# Altium project MB1115.PrjPCB
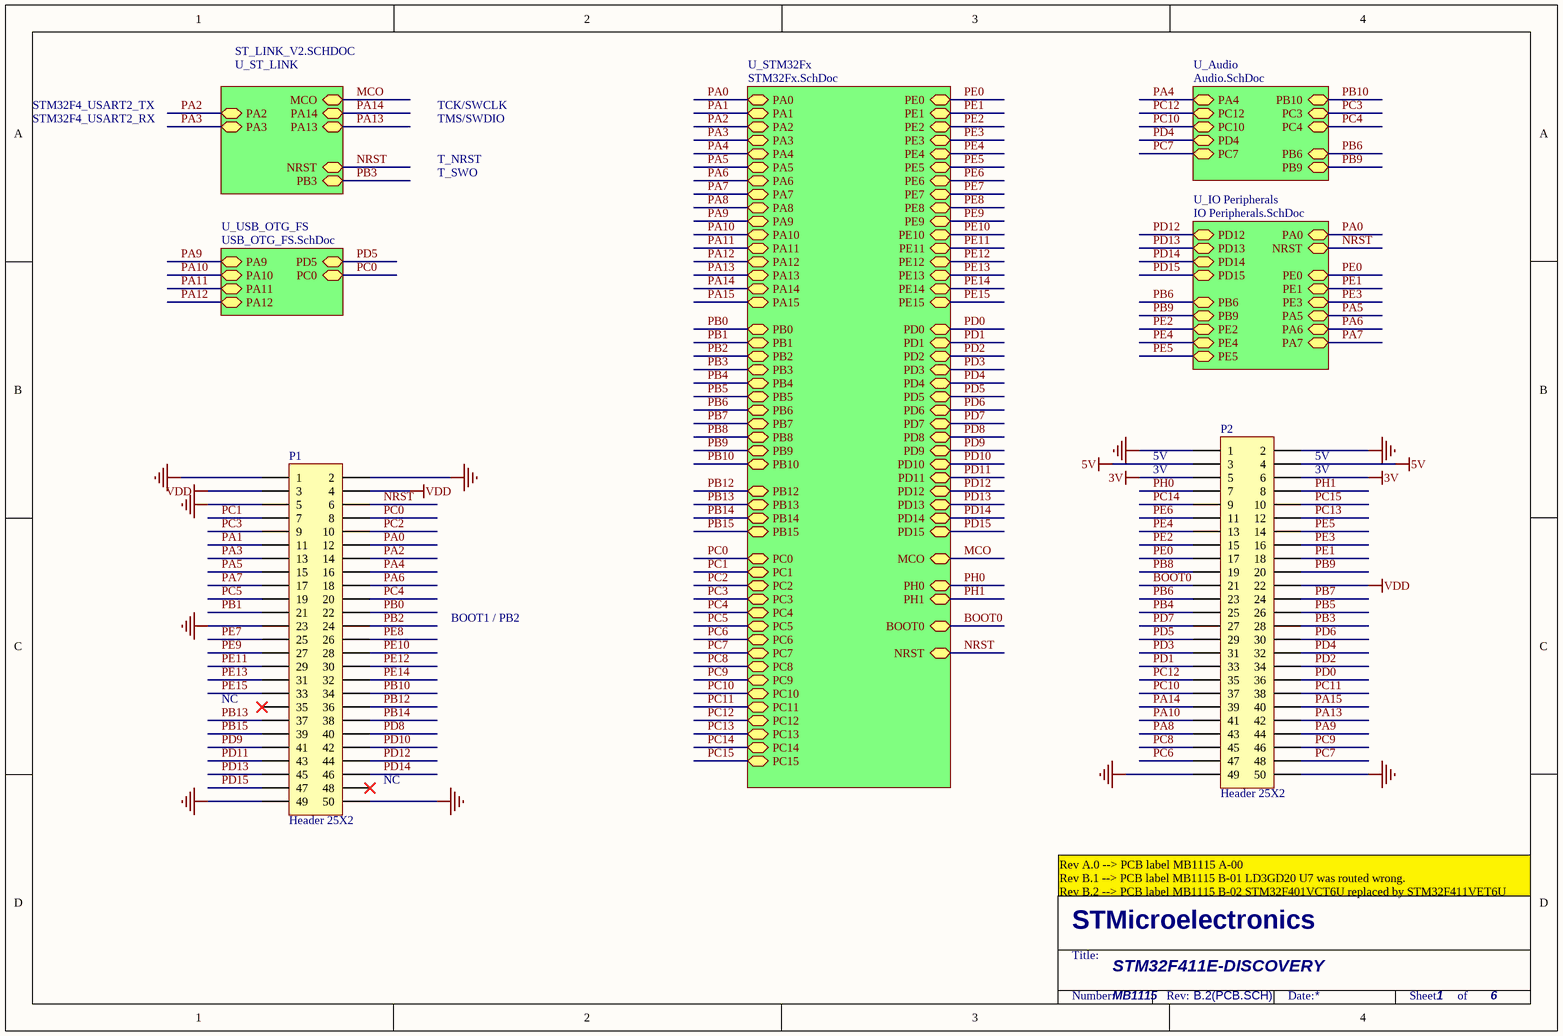
[diagram p0: MB1115.SchDoc]
6 sheets, 194 parts. Net scope: hierarchical (ports join the sheet entries above them; power ports are global).
Sheets:
  MB1115.SchDoc
    U_ST_LINK = ST_LINK_V2.SCHDOC
    U_Audio = Audio.SchDoc
    U_IO Peripherals = IO Peripherals.SchDoc
    U_STM32Fx = STM32Fx.SchDoc
    U_USB_OTG_FS = USB_OTG_FS.SchDoc

## Sheet MB1115.SchDoc
size A4; DocumentNumber: 1; Revision: B.2(PCB.SCH); SheetNumber: 1; SheetTotal: 6; PageSetup: Record=PageOptions|CenterHorizontal=True|CenterVertical=True|PrintScale=1.00|XCorrection=1.00|YCorrection=1.00|PrintKind=1|BorderSize=5000000|LeftOffset=0|BottomOffset=0|Orientation=2|PaperLength=1000|PaperWidth=1000|Scale=100|PaperSource=15|PrintQuality=1200|MediaType=1|DitherType=10|PaperKind=A4|PrintScaleMode=1

### Parts
P1  Header 25X2  [HDR2X25]
P2  Header 25X2  [HDR2X25]

### Sub-sheets
U_Audio = Audio.SchDoc: PA4, PC12, PC10, PD4, PC7, PC3, PB10, PC4, PB6, PB9
U_IO Peripherals = IO Peripherals.SchDoc: PA0, NRST, PE0, PE1, PE3, PA5, PA7, PA6, PE4, PE5, PE2, PB6, PB9, PD12, PD13, PD14, PD15
U_ST_LINK = ST_LINK_V2.SCHDOC: PA13, PA14, NRST, PB3, MCO, PA3, PA2
U_STM32Fx = STM32Fx.SchDoc: PD2, BOOT0, PH1, PH0, NRST, PE0, PE1, PE2, PE3, PE4, PE5, PE6, PE7, PE8, PE9, PE10, PE11, PE12, PE13, PE14, PE15, PD0, PD1, PD3, PD4, PD5, PD6, PD7, PD8, PD9, PD10, PD11, PD12, PD13, PD14, PD15, MCO, PA1, PA2, PA3, PA4, PA5, PA6, PA7, PA8, PA9, PA10, PA11, PA12, PA13, PA14, PA15, PB1, PB2, PB3, PB4, PB5, PB6, PB7, PB8, PB9, PB10, PB12, PB13, PB14, PB15, PC1, PC2, PC3, PC4, PC5, PC6, PC7, PC8, PC9, PC10, PC11, PC12, PC13, PA0, PB0, PC0, PC14, PC15
U_USB_OTG_FS = USB_OTG_FS.SchDoc: PC0, PD5, PA9, PA10, PA11, PA12

### Nets
3V: P2.5 P2.6
5V: P2.3 P2.4
GND: P1.1 P1.2 P1.5 P1.23 P1.49 P1.50 P2.1 P2.2 P2.49 P2.50
VDD: P1.3 P1.4 P2.22
BOOT0: P2.21 ; sheet U_STM32Fx/BOOT0
MCO: sheet U_ST_LINK/MCO, sheet U_STM32Fx/MCO
NRST: P1.6 ; sheet U_ST_LINK/NRST, sheet U_IO Peripherals/NRST, sheet U_STM32Fx/NRST
PA0: P1.12 ; sheet U_IO Peripherals/PA0, sheet U_STM32Fx/PA0
PA1: P1.11 ; sheet U_STM32Fx/PA1
PA2: P1.14 ; sheet U_ST_LINK/PA2, sheet U_STM32Fx/PA2
PA3: P1.13 ; sheet U_ST_LINK/PA3, sheet U_STM32Fx/PA3
PA4: P1.16 ; sheet U_Audio/PA4, sheet U_STM32Fx/PA4
PA5: P1.15 ; sheet U_IO Peripherals/PA5, sheet U_STM32Fx/PA5
PA6: P1.18 ; sheet U_IO Peripherals/PA6, sheet U_STM32Fx/PA6
PA7: P1.17 ; sheet U_IO Peripherals/PA7, sheet U_STM32Fx/PA7
PA8: P2.43 ; sheet U_STM32Fx/PA8
PA9: P2.44 ; sheet U_STM32Fx/PA9, sheet U_USB_OTG_FS/PA9
PA10: P2.41 ; sheet U_STM32Fx/PA10, sheet U_USB_OTG_FS/PA10
PA11: sheet U_STM32Fx/PA11, sheet U_USB_OTG_FS/PA11
PA12: sheet U_STM32Fx/PA12, sheet U_USB_OTG_FS/PA12
PA13: P2.42 ; sheet U_ST_LINK/PA13, sheet U_STM32Fx/PA13
PA14: P2.39 ; sheet U_ST_LINK/PA14, sheet U_STM32Fx/PA14
PA15: P2.40 ; sheet U_STM32Fx/PA15
PB0: P1.22 ; sheet U_STM32Fx/PB0
PB1: P1.21 ; sheet U_STM32Fx/PB1
PB2: P1.24 ; sheet U_STM32Fx/PB2
PB3: P2.28 ; sheet U_ST_LINK/PB3, sheet U_STM32Fx/PB3
PB4: P2.25 ; sheet U_STM32Fx/PB4
PB5: P2.26 ; sheet U_STM32Fx/PB5
PB6: P2.23 ; sheet U_Audio/PB6, sheet U_IO Peripherals/PB6, sheet U_STM32Fx/PB6
PB7: P2.24 ; sheet U_STM32Fx/PB7
PB8: P2.19 ; sheet U_STM32Fx/PB8
PB9: P2.20 ; sheet U_Audio/PB9, sheet U_IO Peripherals/PB9, sheet U_STM32Fx/PB9
PB10: P1.34 ; sheet U_Audio/PB10, sheet U_STM32Fx/PB10
PB12: P1.36 ; sheet U_STM32Fx/PB12
PB13: P1.37 ; sheet U_STM32Fx/PB13
PB14: P1.38 ; sheet U_STM32Fx/PB14
PB15: P1.39 ; sheet U_STM32Fx/PB15
PC0: P1.8 ; sheet U_STM32Fx/PC0, sheet U_USB_OTG_FS/PC0
PC1: P1.7 ; sheet U_STM32Fx/PC1
PC2: P1.10 ; sheet U_STM32Fx/PC2
PC3: P1.9 ; sheet U_Audio/PC3, sheet U_STM32Fx/PC3
PC4: P1.20 ; sheet U_Audio/PC4, sheet U_STM32Fx/PC4
PC5: P1.19 ; sheet U_STM32Fx/PC5
PC6: P2.47 ; sheet U_STM32Fx/PC6
PC7: P2.48 ; sheet U_Audio/PC7, sheet U_STM32Fx/PC7
PC8: P2.45 ; sheet U_STM32Fx/PC8
PC9: P2.46 ; sheet U_STM32Fx/PC9
PC10: P2.37 ; sheet U_Audio/PC10, sheet U_STM32Fx/PC10
PC11: P2.38 ; sheet U_STM32Fx/PC11
PC12: P2.35 ; sheet U_Audio/PC12, sheet U_STM32Fx/PC12
PC13: P2.12 ; sheet U_STM32Fx/PC13
PC14: P2.9 ; sheet U_STM32Fx/PC14
PC15: P2.10 ; sheet U_STM32Fx/PC15
PD0: P2.36 ; sheet U_STM32Fx/PD0
PD1: P2.33 ; sheet U_STM32Fx/PD1
PD2: P2.34 ; sheet U_STM32Fx/PD2
PD3: P2.31 ; sheet U_STM32Fx/PD3
PD4: P2.32 ; sheet U_Audio/PD4, sheet U_STM32Fx/PD4
PD5: P2.29 ; sheet U_STM32Fx/PD5, sheet U_USB_OTG_FS/PD5
PD6: P2.30 ; sheet U_STM32Fx/PD6
PD7: P2.27 ; sheet U_STM32Fx/PD7
PD8: P1.40 ; sheet U_STM32Fx/PD8
PD9: P1.41 ; sheet U_STM32Fx/PD9
PD10: P1.42 ; sheet U_STM32Fx/PD10
PD11: P1.43 ; sheet U_STM32Fx/PD11
PD12: P1.44 ; sheet U_IO Peripherals/PD12, sheet U_STM32Fx/PD12
PD13: P1.45 ; sheet U_IO Peripherals/PD13, sheet U_STM32Fx/PD13
PD14: P1.46 ; sheet U_IO Peripherals/PD14, sheet U_STM32Fx/PD14
PD15: P1.47 ; sheet U_IO Peripherals/PD15, sheet U_STM32Fx/PD15
PE0: P2.17 ; sheet U_IO Peripherals/PE0, sheet U_STM32Fx/PE0
PE1: P2.18 ; sheet U_IO Peripherals/PE1, sheet U_STM32Fx/PE1
PE2: P2.15 ; sheet U_IO Peripherals/PE2, sheet U_STM32Fx/PE2
PE3: P2.16 ; sheet U_IO Peripherals/PE3, sheet U_STM32Fx/PE3
PE4: P2.13 ; sheet U_IO Peripherals/PE4, sheet U_STM32Fx/PE4
PE5: P2.14 ; sheet U_IO Peripherals/PE5, sheet U_STM32Fx/PE5
PE6: P2.11 ; sheet U_STM32Fx/PE6
PE7: P1.25 ; sheet U_STM32Fx/PE7
PE8: P1.26 ; sheet U_STM32Fx/PE8
PE9: P1.27 ; sheet U_STM32Fx/PE9
PE10: P1.28 ; sheet U_STM32Fx/PE10
PE11: P1.29 ; sheet U_STM32Fx/PE11
PE12: P1.30 ; sheet U_STM32Fx/PE12
PE13: P1.31 ; sheet U_STM32Fx/PE13
PE14: P1.32 ; sheet U_STM32Fx/PE14
PE15: P1.33 ; sheet U_STM32Fx/PE15
PH0: P2.7 ; sheet U_STM32Fx/PH0
PH1: P2.8 ; sheet U_STM32Fx/PH1

Not connected (* = marked no-connect by the designer): P1 35* 48*

### Notes on the sheet
- STM32F4_USART2_TX
- TCK/SWCLK
- STM32F4_USART2_RX
- TMS/SWDIO
- T_SWO
- T_NRST
- 5V
- 3V
- (near P2) 5V
- (near P2) 3V
- BOOT1 / PB2
- NC
- (near P1) NC
- Rev A.0 --> PCB label MB1115 A-00
  Rev B.1 --> PCB label MB1115 B-01 LD3GD20 U7 was routed wrong.
  Rev B.2 --> PCB label MB1115 B-02 STM32F401VCT6U replaced by STM32F411VET6U
- STM32F411E-DISCOVERY
- MB1115
- 1
- STMicroelectronics
- Title:
- Number:
- Rev:
- Date:
- Sheet       of

### Library data of the parts
P1 P2 = Header 25X2: Header, 25-Pin, Dual row; LatestRevisionDate: 17-Jul-2002; LatestRevisionNote: Re-released for DXP Platform.; Publisher: Altium Limited

## Sheet ST_LINK_V2.SCHDOC
size A4; DocumentNumber: 2; Revision: B.2(PCB.SCH); SheetNumber: 2; SheetTotal: 6
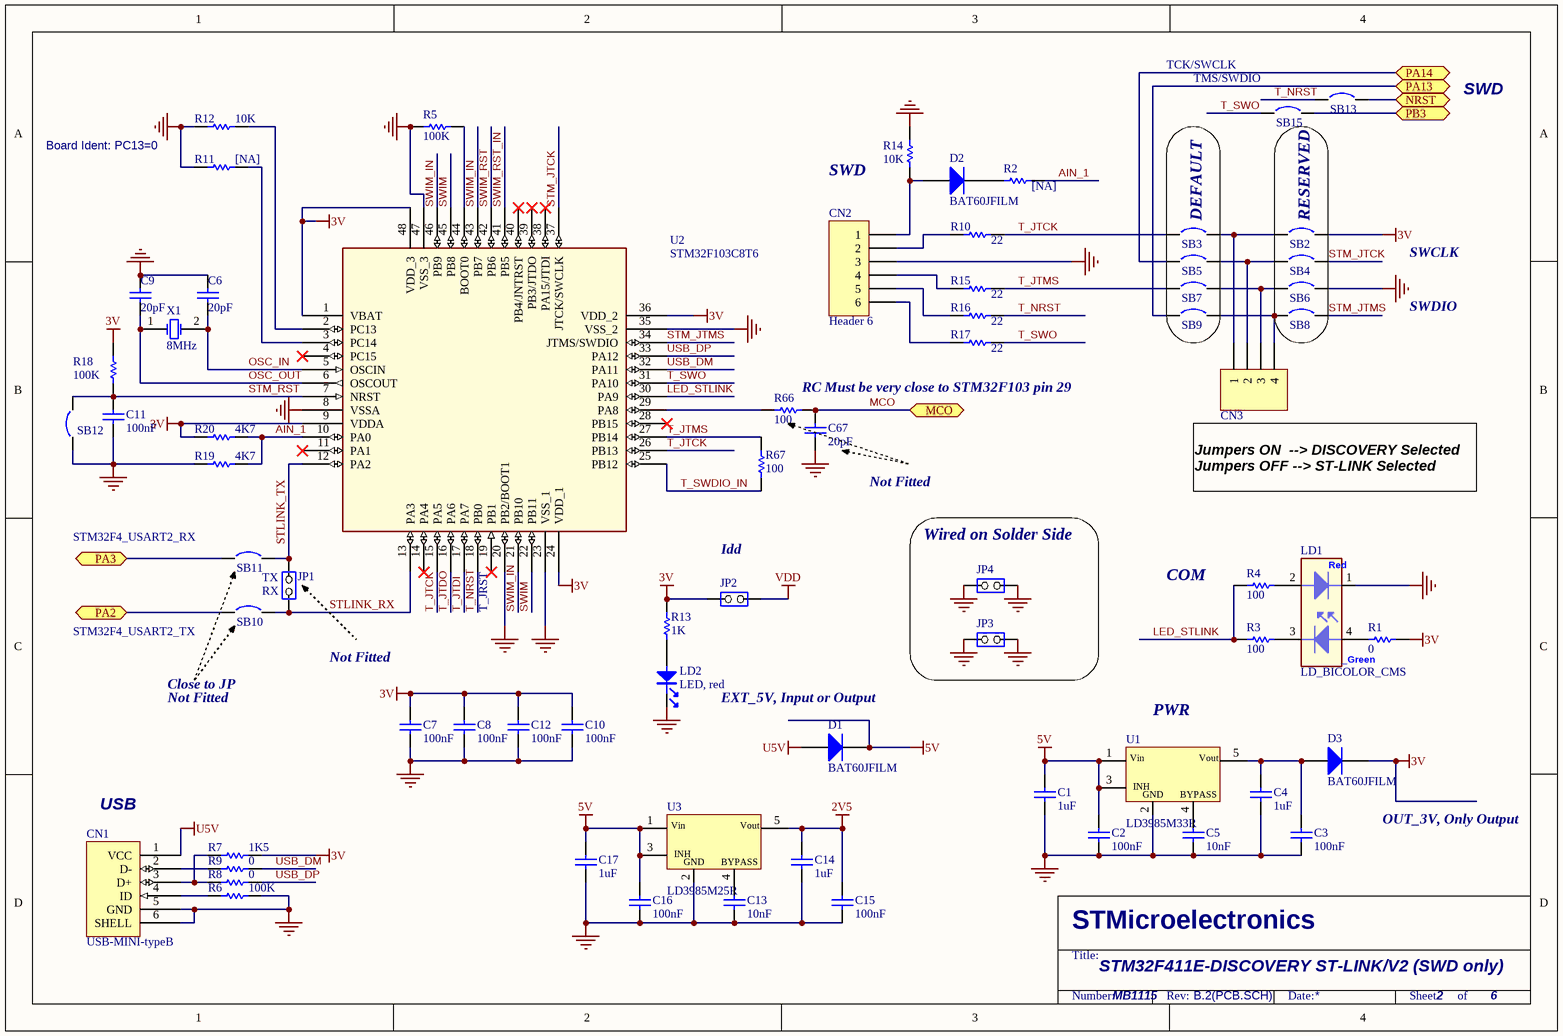
[diagram p1: ST_LINK_V2.SCHDOC]

### Parts
C1  1uF  [0603C]
C2  100nF  [0402C]
C3  100nF  [0402C]
C4  1uF  [0603C]
C5  10nF  [0603C]
C6  20pF  [0402C]
C7  100nF  [0402C]
C8  100nF  [0402C]
C9  20pF  [0402C]
C10  100nF  [0402C]
C11  100nF  [0402C]
C12  100nF  [0402C]
C13  10nF  [0603C]
C14  1uF  [0603C]
C15  100nF  [0402C]
C16  100nF  [0402C]
C17  1uF  [0603C]
C67  20pF  [0402C]
CN1  USB-MINI-typeB  [USB-MINI-B-SMD]
CN2  Header 6  [HDR1X6]
CN3  Header 4  [Header 4]  (value not drawn)
D1  BAT60JFILM  [SOD323/A]
D2  BAT60JFILM  [SOD323/A]
D3  BAT60JFILM  [SOD323/A]
JP1  JP2  [SIP2/2.54]  (value not drawn)
JP2  (no value)  [SIP2/2.54]
JP3  (no value)  [SIP2/2.54]
JP4  (no value)  [SIP2/2.54]
LD1  LD_BICOLOR_CMS  [HSMF-A201]
LD2  LED, red  [0603D]
R1  0  [0402R]
R2  [NA]  [0402R]
R3  100  [0402R]
R4  100  [0402R]
R5  100K  [0402R]
R6  100K  [0402R]
R7  1K5  [0402R]
R8  0  [0402R]
R9  0  [0402R]
R10  22  [0402R]
R11  [NA]  [0402R]
R12  10K  [0402R]
R13  1K  [0402R]
R14  10K  [0402R]
R15  22  [0402R]
R16  22  [0402R]
R17  22  [0402R]
R18  100K  [0402R]
R19  4K7  [0402R]
R20  4K7  [0402R]
R66  100  [0402R]
R67  100  [0402R]
SB2  Circuit Breaker  [JP2_SMD]  (value not drawn)
SB3  Circuit Breaker  [JP2_SMD]  (value not drawn)
SB4  Circuit Breaker  [JP2_SMD]  (value not drawn)
SB5  Circuit Breaker  [JP2_SMD]  (value not drawn)
SB6  Circuit Breaker  [JP2_SMD]  (value not drawn)
SB7  Circuit Breaker  [JP2_SMD]  (value not drawn)
SB8  Circuit Breaker  [JP2_SMD]  (value not drawn)
SB9  Circuit Breaker  [JP2_SMD]  (value not drawn)
SB10  Circuit Breaker  [JP2_SMD]  (value not drawn)
SB11  Circuit Breaker  [JP2_SMD]  (value not drawn)
SB12  Circuit Breaker  [JP2_SMD]  (value not drawn)
SB13  Circuit Breaker  [JP2_SMD]  (value not drawn)
SB15  Circuit Breaker  [JP2_SMD]  (value not drawn)
U1  LD3985M33R  [SOT-23-5L]
U2  STM32F103C8T6  [QFP48 7X7]
U3  LD3985M25R  [SOT-23-5L]
X1  8MHz  [XTAL1]

### Blocks framed on the sheet
DEFAULT: SB3 SB5 SB7 SB9
RESERVED: SB2 SB4 SB6 SB8
Wired on Solder Side: JP3 JP4

### Ports
MCO, NRST, PA2, PA3, PA13, PA14, PB3

### Nets
2V5: C14.1 C15.2 U3.5(Vout)
3V: C7.2 C8.2 C10.2 C12.1 D3.2(K) JP2.1(COMMON) R1.2 R7.2 R13.2 R18.2 R20.1 SB2.2 U2.1(VBAT) U2.9(VDDA) U2.24(VDD_1) U2.36(VDD_2) U2.48(VDD_3)
5V: C1.2 C2.2 C16.2 C17.2 D1.2(K) U1.1(Vin) U1.3(CE) U3.1(Vin) U3.3(CE)
GND: C1.1 C2.1 C3.1 C4.2 C5.1 C6.1 C7.1 C8.1 C9.1 C10.1 C11.1 C12.2 C13.1 C14.2 C15.1 C16.1 C17.1 C67.2 CN1.5(GND) CN1.6(SHELL) CN2.3 JP3.1(COMMON) JP3.2(NO) JP4.1(COMMON) JP4.2(NO) LD1.1 LD2.2 R5.1 R6.2 R11.1 R12.1 R14.2 R19.1 SB6.2 SB12.1 U1.2(GND) U2.8(VSSA) U2.20(PB2/BOOT1) U2.23(VSS_1) U2.35(VSS_2) U2.47(VSS_3) U3.2(GND)
U5V: CN1.1(VCC) D1.1(A)
VDD: JP2.2(NO)
AIN_1: R2.2 R19.2 R20.2 U2.10(PA0)
LED_STLINK: R3.1 R4.1 U2.30(PA9)
MCO: C67.1 R66.2 ; port MCO
NRST: SB13.2 ; port NRST
OSC_IN: C6.2 U2.5(OSCIN) X1.2(OSC2)
OSC_OUT: C9.2 U2.6(OSCOUT) X1.1(OSC1)
PA2: SB10.1 ; port PA2
PA3: SB11.1 ; port PA3
PA13: SB9.1 ; port PA13
PA14: SB5.1 ; port PA14
PB3: SB15.2 ; port PB3
STLINK_RX: JP1.1(COMMON) SB10.2 U2.13(PA3)
STLINK_TX: JP1.2(NO) SB11.2 U2.12(PA2)
STM_JTCK: SB4.2 U2.37(JTCK/SWCLK)
STM_JTMS: SB8.2 U2.34(JTMS/SWDIO)
STM_RST: C11.2 R18.1 SB12.2 U2.7(NRST)
SWIM: U2.22(PB11) U2.45(PB8)
SWIM_IN: U2.21(PB10) U2.43(PB7) U2.46(PB9)
SWIM_RST: U2.42(PB6)
SWIM_RST_IN: U2.41(PB5)
T_JTCK: R10.2 SB3.1 U2.15(PA5) U2.26(PB13)
T_JTDI: U2.17(PA7)
T_JTDO: U2.16(PA6)
T_JTMS: R15.2 R67.2 SB7.1 U2.27(PB14)
T_NRST: R16.2 SB13.1 U2.18(PB0)
T_SWDIO_IN: R67.1 U2.25(PB12)
T_SWO: R17.2 SB15.1 U2.31(PA10)
USB_DM: R9.2 U2.32(PA11)
USB_DP: R8.2 U2.33(PA12)
NetC3_2: C3.2 C4.1 D3.1(A) U1.5(Vout)
NetC5_2: C5.2 U1.4(BYPASS)
NetC13_2: C13.2 U3.4(BYPASS)
NetCN1_2: CN1.2(D-) R9.1
NetCN1_3: CN1.3(D+) R7.1 R8.1
NetCN1_4: CN1.4(ID) R6.1
NetCN2_1: CN2.1 D2.1(A) R14.1
NetCN2_2: CN2.2 R10.1
NetCN2_4: CN2.4 R15.1
NetCN2_5: CN2.5 R16.1
NetCN2_6: CN2.6 R17.1
NetCN3_1: CN3.1 SB2.1 SB3.2
NetCN3_2: CN3.2 SB4.1 SB5.2
NetCN3_3: CN3.3 SB6.1 SB7.2
NetCN3_4: CN3.4 SB8.1 SB9.2
NetD2_2: D2.2(K) R2.1
NetLD1_2: LD1.2 R4.2
NetLD1_3: LD1.3 R3.2
NetLD1_4: LD1.4 R1.1
NetLD2_1: LD2.1 R13.1
NetR5_2: R5.2 U2.44(BOOT0)
NetR11_2: R11.2 U2.3(PC14)
NetR12_2: R12.2 U2.2(PC13)
NetR66_1: R66.1 U2.29(PA8)

Not connected (* = marked no-connect by the designer): U2 4(PC15)* 11(PA1)* 14(PA4)* 19(PB1)* 28(PB15)* 38(PA15/JTDI)* 39(PB3/JTDO)* 40(PB4/JNTRST)*

### Notes on the sheet
- TCK/SWCLK
- (near SB15) TMS/SWDIO
- SWD
- Board Ident: PC13=0
- SWCLK
- SWDIO
- (near R66) RC Must be very close to STM32F103 pin 29
- Not Fitted
- Jumpers ON  --> DISCOVERY Selected
  Jumpers OFF --> ST-LINK Selected
- STM32F4_USART2_RX
- TX
- (near JP2) Idd
- COM
- STM32F4_USART2_TX
- RX
- (near U2) T_JRST
- Close to JP
- EXT_5V, Input or Output
- (near U1) PWR
- (near CN1) USB
- OUT_3V, Only Output
- STM32F411E-DISCOVERY ST-LINK/V2 (SWD only)
- MB1115
- STMicroelectronics
- Title:
- Number:
- Rev:
- Date:
- Sheet       of
- (in symbol LD3985M25R) INH
- (in symbol LD3985M33R) INH
- (in symbol LD_BICOLOR_CMS) Red; _Green

### Library data of the parts
C1 C4 C14 C17 = Cap_1uF_X5R_10%_0603: Capacitor,1uF,16V,X5R,10%,0603,YAGEO; Manuf_Part_1: CC0603KRX5R7BB105; Revision: July-2002: Re-released for DXP Platform.; Value: 1uF; Order: CC0603KRX5R7BB105; Manuf_1: YAGEO
C2 C3 C7 C8 C10-C12 C15 C16 = Cap_100nF_X7R_10%_0402: Capacitor,100nF,16V,X7R,10%,0402,YAGEO; Manuf_Part_1: CC0402KRX7R7BB104; Revision: July-2002: Re-released for DXP Platform.; Value: 100nF; Order: CC0402KRX7R7BB104; Manuf_1: YAGEO
C5 C13 = Cap_10nF_X7R_10%_0603: Capacitor,10nF,50V,X7R,10%,0603,YAGEO; Manuf_Part_1: CC0603KRX7R9BB103; Revision: July-2002: Re-released for DXP Platform.; Value: 10nF; Order: CC0603KRX7R9BB103; Manuf_1: YAGEO
C6 C9 = Cap_20pF_NPO_5%_0402: Capacitor,20pF,50V,NPO,5%,0402,YAGEO; Order: CC0402JRNPO9BN200; Revision: July-2002: Re-released for DXP Platform.; Value: 20pF; Manuf_1: YAGEO; Manuf_Part_1: CC0402JRNPO9BN200
C67 = Cap_20pF_NPO_5%_0402: Capacitor,20pF,50V,NPO,5%,0402,YAGEO; Order: CC0402JRNPO9BN200; Fitted: NO; Revision: July-2002: Re-released for DXP Platform.; Value: 20pF; Manuf_1: YAGEO; Manuf_Part_1: CC0402JRNPO9BN200
CN1 = USB-MINI-typeB connector: Manuf_Part_1: 5075BMR-05-SM; Manuf_Part_2: 218205M1110T; Manuf_2: lyconn; Description: USB,MINI-USB-5P/F, 5075BMR-05-M; Order: 5075BMR-05-SM
CN2 = Header 6: Header, 6-Pin; LatestRevisionDate: 17-Jul-2002; LatestRevisionNote: Re-released for DXP Platform.; Publisher: Altium Limited
CN3 = Header 4: Header, 4-Pin; Revision: 17-Jul-2002: Re-released for DXP Platform.; Publisher: Altium Limited
D1-D3 = BAT60JFILM: Manuf_1: STM; Provided: ST; ECCN_US/EU: EAR99/NEC; Ref St: 9151097; Revision: July-2002: Re-released for DXP Platform.; Order: BAT60JFILM; Manuf_Part_1: BAT60JFILM; Distrib: ST
JP1 = JP2: Fitted: NO
JP2-JP4 = JP2
LD1 = LD_BICOLOR_CMS: Bicolor Led; Manuf_Part_1: HSMF-A201-A00J1; Manuf_1: Avago Technologies; Manuf_2: everluck; Manuf_Part_2: LE-RGW35280; Ref St: xxxxxx; Distrib: RADIOSPARES
LD2 = LED_red: LED, red, 0603; Manuf_1: everlight; Manuf_Part_1: 19-213-R6C-AP1Q2B/3T; Description: LED,red,0603,19-213-R6C-AP1Q2B/3T,everlight; Order: 19-213-R6C-AP1Q2B/3T
R1 R8 R9 = Res_0_0402: Resistor,0,0402; Value: 0
R2 R11 = Res_NA_0402: Resistor,[NA],0402; Fitted: NO; Value: [NA]
R3-R7 R10 R12-R20 R67 = res1: Resistor; Published: 8-Jun-2000; Revision: July-2002: Re-released for DXP Platform.; Publisher: Altium Limited
  R3 R4 R67: Value: 100
  R5 R6 R18: Value: 100K
  R7: Value: 1K5
  R10 R15-R17: Value: 22
  R12 R14: Value: 10K
  R13: Value: 1K
  R19 R20: Value: 4K7
R66 = res1: Resistor; Fitted: NO; Published: 8-Jun-2000; Revision: July-2002: Re-released for DXP Platform.; Publisher: Altium Limited; Value: 100
SB2 SB4 SB6 SB8 SB10-SB12 = Circuit Breaker: Solder: NO; Revision: July-2002: Re-released for DXP Platform.
SB3 SB5 SB7 SB9 SB13 SB15 = Circuit Breaker: Solder: YES; Revision: July-2002: Re-released for DXP Platform.
U1 = LD3985M33R: Ultra low drop-low noise BiCMOS voltage, regulators low ESR capacitors compatible; Manuf_1: STM; Provided: ST; Ref St: 9176161; ECCN_US/EU: EAR99/NEC; Manuf_Part_1: LD3985M33R; Distrib: ST; Order: LD3985M33R
U2 = STM32F103C8T6: Medium-density performance line ARM-based 32-bit MCU with 64KB Flash; Manuf_1: STM; Ref St: 9175981; Provided: ST; ECCN_US/EU: 3A991A2/NEC; Manuf_Part_1: STM32F103C8T6; Distrib: ST; Order: STM32F103C8T6
U3 = LD3985M25R: Ultra low drop-low noise BiCMOS voltage, regulators low ESR capacitors compatible; Manuf_1: STM; Provided: ST; Ref St: 9176007; ECCN_US/EU: EAR99/NEC; Manuf_Part_1: LD3985M25R; Order: LD3985M25R; Distrib: ST
X1 = XTAL_8MHZ_20PPM: Crystal Oscillator,8Mhz,20PF,20PPM,-10-70 degree,DIP,HC-49S; Manuf_Part_1: HC-49S-C20QSA-8.000MHZ; Order: HC-49S-C20QSA-8.000MHZ

## Sheet Audio.SchDoc
size A4; DocumentNumber: 4; Revision: B.2(PCB.SCH); SheetNumber: 4; SheetTotal: 6
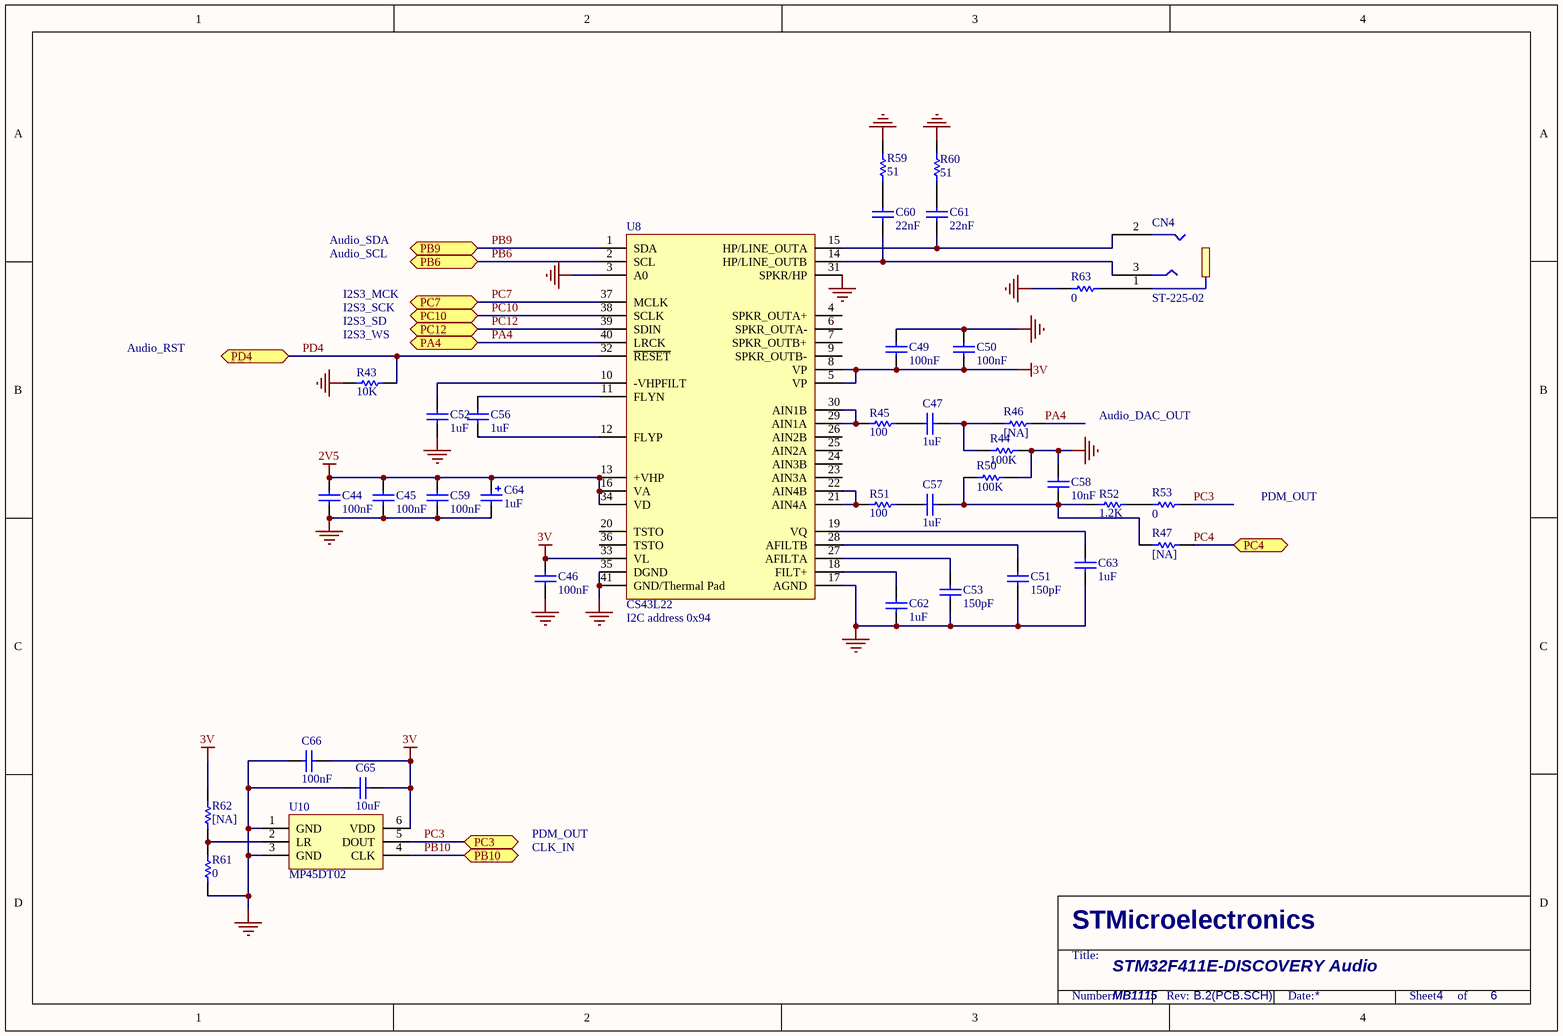
[diagram p2: Audio.SchDoc]

### Parts
C44  100nF  [0402C]
C45  100nF  [0402C]
C46  100nF  [0402C]
C47  1uF  [0603C]
C49  100nF  [0402C]
C50  100nF  [0402C]
C51  150pF  [0603C]
C52  1uF  [0603C]
C53  150pF  [0603C]
C56  1uF  [0603C]
C57  1uF  [0603C]
C58  10nF  [0603C]
C59  100nF  [0402C]
C60  22nF  [0603C]
C61  22nF  [0603C]
C62  1uF  [0603C]
C63  1uF  [0603C]
C64  1uF  [TAN-A]
C65  10uF  [0603C]
C66  100nF  [0402C]
CN4  ST-225-02  [Jack-ST-225]
R43  10K  [0402R]
R44  100K  [0402R]
R45  100  [0402R]
R46  [NA]  [0402R]
R47  [NA]  [0402R]
R50  100K  [0402R]
R51  100  [0402R]
R52  1.2K  [0402R]
R53  0  [0402R]
R59  51  [0402R]
R60  51  [0402R]
R61  0  [0402R]
R62  [NA]  [0402R]
R63  0  [0402R]
U8  CS43L22  [QFN40]
U10  MP45DT02  [HLGA-4.72-3.76-6LD]

### Ports
PA4, PB6, PB9, PB10, PC3, PC4, PC7, PC10, PC12, PD4

### Nets
2V5: C44.2 C45.2 C59.2 C64.1 U8.13(+VHP) U8.16(VA) U8.34(VD)
3V: C46.2 C49.1 C50.2 C65.2 C66.2 R62.2 U8.5(VP) U8.8(VP) U8.33(VL) U10.6(VDD)
GND: C44.1 C45.1 C46.1 C49.2 C50.1 C51.1 C52.2 C53.1 C58.2 C59.1 C62.1 C63.1 C64.2 C65.1 C66.1 R43.2 R44.2 R50.2 R59.2 R60.1 R61.1 R63.1 U8.3(A0) U8.17(AGND) U8.31(SPKR/HP) U8.35(DGND) U8.41(GND/Thermal_Pad) U10.1(GND) U10.3(GND)
PA4: R46.2 U8.40(LRCK) ; port PA4
PB6: U8.2(SCL) ; port PB6
PB9: U8.1(SDA) ; port PB9
PB10: U10.4(CLK) ; port PB10
PC3: R53.2 U10.5(DOUT) ; port PC3
PC4: R47.2 ; port PC4
PC7: U8.37(MCLK) ; port PC7
PC10: U8.38(SCLK) ; port PC10
PC12: U8.39(SDIN) ; port PC12
PD4: R43.1 U8.32(~{RESET}) ; port PD4
NetC47_1: C47.1 R45.1
NetC47_2: C47.2 R44.1 R46.1
NetC51_2: C51.2 U8.28(AFILTB)
NetC52_1: C52.1 U8.10(-VHPFILT)
NetC53_2: C53.2 U8.27(AFILTA)
NetC56_1: C56.1 U8.12(FLYP)
NetC56_2: C56.2 U8.11(FLYN)
NetC57_1: C57.1 R51.1
NetC57_2: C57.2 C58.1 R47.1 R50.1 R52.1
NetC60_1: C60.1 CN4.3 U8.14(HP/LINE_OUTB)
NetC60_2: C60.2 R59.1
NetC61_1: C61.1 CN4.2 U8.15(HP/LINE_OUTA)
NetC61_2: C61.2 R60.2
NetC62_2: C62.2 U8.18(FILT+)
NetC63_2: C63.2 U8.19(VQ)
NetCN4_1: CN4.1 R63.2
NetR45_2: R45.2 U8.29(AIN1A) U8.30(AIN1B)
NetR51_2: R51.2 U8.21(AIN4A) U8.22(AIN4B)
NetR52_2: R52.2 R53.1
NetR61_2: R61.2 R62.1 U10.2(LR)

Not connected (* = marked no-connect by the designer): U8 4(SPKR_OUTA+) 6(SPKR_OUTA-) 7(SPKR_OUTB+) 9(SPKR_OUTB-) 20(TSTO) 23(AIN3A) 24(AIN3B) 25(AIN2A) 26(AIN2B) 36(TSTO)

### Notes on the sheet
- Audio_SDA
- Audio_SCL
- I2S3_MCK
- I2S3_SCK
- Audio_RST
- (near R43) I2S3_WS
- I2S3_SD
- Audio_DAC_OUT
- PDM_OUT
- (near U8) I2C address 0x94
- CLK_IN
- STM32F411E-DISCOVERY Audio
- MB1115
- STMicroelectronics
- Title:
- Number:
- Rev:
- Date:
- Sheet       of

### Library data of the parts
C44-C46 C49 C50 C59 C66 = Cap_100nF_X7R_10%_0402: as C2 on sheet ST_LINK_V2; Revision: July-2002: Re-released for DXP Platform.; Value: 100nF; Order: CC0402KRX7R7BB104; Manuf_1: YAGEO
C47 C52 C56 C57 C62 C63 = Cap_1uF_X5R_10%_0603: as C1 on sheet ST_LINK_V2; Revision: July-2002: Re-released for DXP Platform.; Value: 1uF; Order: CC0603KRX5R7BB105; Manuf_1: YAGEO
C51 C53 = Cap_150pF_NPO_5%_0603: Capacitor,150pF,50V,NPO,5%,0603,YAGEO; Order: CC0603JRNPO9BN151; Revision: July-2002: Re-released for DXP Platform.; Value: 150pF; Manuf_1: YAGEO; Manuf_Part_1: CC0603JRNPO9BN151
C58 = Cap_10nF_X7R_10%_0603: as C5 on sheet ST_LINK_V2; Revision: July-2002: Re-released for DXP Platform.; Value: 10nF; Order: CC0603KRX7R9BB103; Manuf_1: YAGEO
C60 C61 = Cap_22nF_X7R_10%_0603: Capacitor,22nF,50V,X7R,10%,0603,YAGEO; Manuf_Part_1: CC0603KRX7R9BB223; Revision: July-2002: Re-released for DXP Platform.; Value: 22nF; Order: CC0603KRX7R9BB223; Manuf_1: YAGEO
C64 = Cap_1uF_POL_10%_TANA: Polarized Capacitor,1uF,16V,10%,typeA,AVX; Manuf_Part_1: TAJA105K016R; Revision: July-2002: Re-released for DXP Platform.; Value: 1uF; Manuf_1: AVX; Distrib: *; Order: TAJA105K016R
C65 = Cap_10uF_X5R_10%_0603: Capacitor,10uF,6.3V,X5R,20%,0603,YAGEO; Manuf_Part_1: CC0603KRX5R5BB106; Revision: July-2002: Re-released for DXP Platform.; Value: 10uF; Order: CC0603KRX5R5BB106; Manuf_1: YAGEO
CN4 = ST-225-02: Connector Jack 35mm; Manuf_1: XIEJIA Electronics; Order: ST-225-02; Manuf_Part_1: ST-225-02
R43-R45 R50 R51 R59 R60 = res1: Resistor; Value: 1K; Published: 8-Jun-2000; Revision: July-2002: Re-released for DXP Platform.; Publisher: Altium Limited
R46 R47 R62 = Res_NA_0402: Resistor,[NA],0402; Fitted: NO; Value: [NA]
R52 = res1: Resistor; Published: 8-Jun-2000; Revision: July-2002: Re-released for DXP Platform.; Publisher: Altium Limited; Value: 1.2K
R53 R61 R63 = Res_0_0402: Resistor,0,0402; Value: 0
U8 = CS43L22: Low Power, Stereo DAC w/Headphone & Speaker Amps; Manuf_1: Cirrus; Order: CS43L22-CNZ; Manuf_Part_1: CS43L22-CNZ; Distrib: *; ECCN_US/EU: *
U10 = MP45DT02: MEMS audio sensor, omnidirectional digital microphone; Manuf_1: STM; Manuf_Part_1: MP45DT02TR; Provided: ST; Ref St: 9188006; ECCN_US/EU: EAR99/NEC; Order: MP45DT02TR; Distrib: ST

## Sheet IO Peripherals.SchDoc
size A4; DocumentNumber: 6; Revision: B.2(PCB.SCH); SheetNumber: 6; SheetTotal: 6
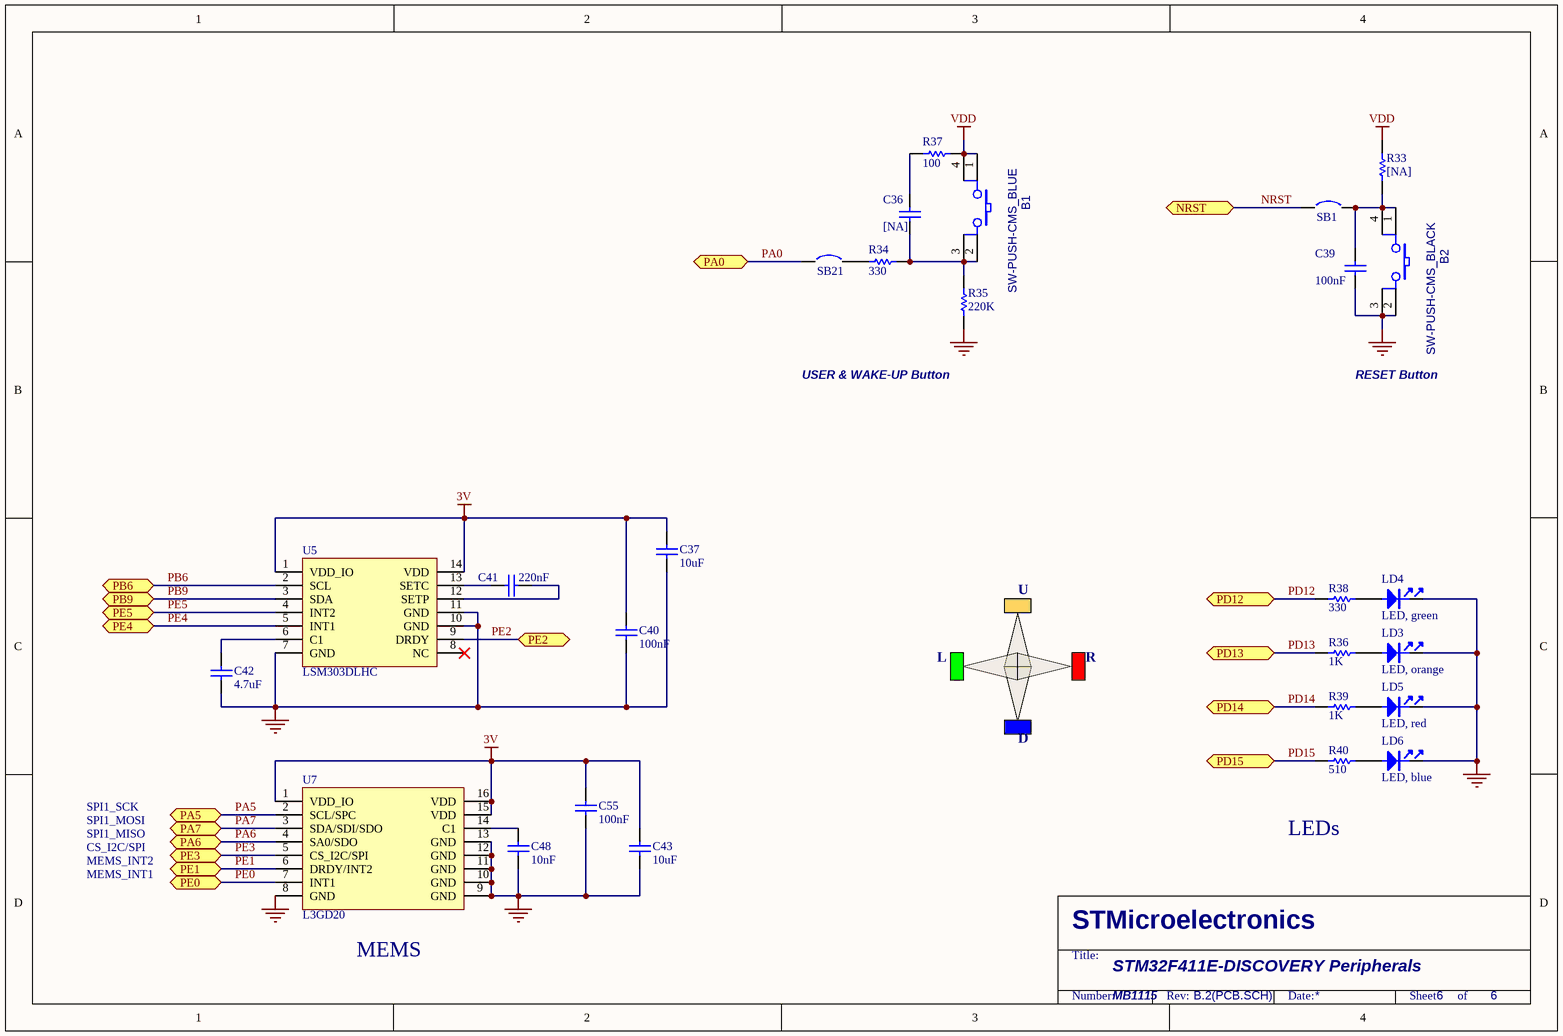
[diagram p3: IO Peripherals.SchDoc]

### Parts
B1  SW-PUSH-CMS_BLUE  [BP1CMS]
B2  SW-PUSH-CMS_BLACK  [BP1CMS]
C36  [NA]  [0402C]
C37  10uF  [0603C]
C39  100nF  [0402C]
C40  100nF  [0402C]
C41  220nF  [0603C]
C42  4.7uF  [0603C]
C43  10uF  [0603C]
C48  10nF  [0603C]
C55  100nF  [0402C]
LD3  LED, orange  [0603D]
LD4  LED, green  [0603D]
LD5  LED, red  [0603D]
LD6  LED, blue  [0603D]
R33  [NA]  [0402R]
R34  330  [0402R]
R35  220K  [0402R]
R36  1K  [0402R]
R37  100  [0402R]
R38  330  [0402R]
R39  1K  [0402R]
R40  510  [0402R]
SB1  Circuit Breaker  [JP2_SMD]  (value not drawn)
SB21  Circuit Breaker  [JP2_SMD]  (value not drawn)
U5  LSM303DLHC  [LGA14(3*5)]
U7  L3GD20  [LGA16-4x4]

### Ports
NRST, PA0, PA5, PA6, PA7, PB6, PB9, PD12, PD13, PD14, PD15, PE0, PE1, PE2, PE3, PE4, PE5

### Nets
3V: C37.2 C40.2 C43.2 C55.2 U5.1(VDD_IO) U5.14(VDD) U7.1(VDD_IO) U7.15(VDD) U7.16(VDD)
GND: B2.2 B2.3 C37.1 C39.1 C40.1 C42.1 C43.1 C48.1 C55.1 LD3.2 LD4.2 LD5.2 LD6.2 R35.1 U5.7(GND) U5.10(GND) U5.11(GND) U7.8(GND) U7.9(GND) U7.10(GND) U7.11(GND) U7.12(GND) U7.13(GND)
VDD: B1.1 B1.4 R33.2 R37.2
NRST: SB1.1 ; port NRST
PA0: SB21.1 ; port PA0
PA5: U7.2(SCL/SPC) ; port PA5
PA6: U7.4(SA0/SDO) ; port PA6
PA7: U7.3(SDA/SDI/SDO) ; port PA7
PB6: U5.2(SCL) ; port PB6
PB9: U5.3(SDA) ; port PB9
PD12: R38.2 ; port PD12
PD13: R36.2 ; port PD13
PD14: R39.2 ; port PD14
PD15: R40.2 ; port PD15
PE0: U7.7(INT1) ; port PE0
PE1: U7.6(DRDY/INT2) ; port PE1
PE2: U5.9(DRDY) ; port PE2
PE3: U7.5(CS_I2C/SPI) ; port PE3
PE4: U5.5(INT1) ; port PE4
PE5: U5.4(INT2) ; port PE5
NetB1_2: B1.2 B1.3 C36.1 R34.2 R35.2
NetB2_1: B2.1 B2.4 C39.2 R33.1 SB1.2
NetC36_2: C36.2 R37.1
NetC41_1: C41.1 U5.13(SETC)
NetC41_2: C41.2 U5.12(SETP)
NetC42_2: C42.2 U5.6(C1)
NetC48_2: C48.2 U7.14(C1)
NetLD3_1: LD3.1 R36.1
NetLD4_1: LD4.1 R38.1
NetLD5_1: LD5.1 R39.1
NetLD6_1: LD6.1 R40.1
NetR34_1: R34.1 SB21.2

Not connected (* = marked no-connect by the designer): U5 8(NC)*

### Notes on the sheet
- USER & WAKE-UP Button
- RESET Button
- U
- L
- R
- D
- SPI1_MOSI
- SPI1_SCK
- SPI1_MISO
- CS_I2C/SPI
- LEDs
- MEMS_INT1
- MEMS_INT2
- (near U7) MEMS
- STM32F411E-DISCOVERY Peripherals
- MB1115
- STMicroelectronics
- Title:
- Number:
- Rev:
- Date:
- Sheet       of

### Library data of the parts
B1 = SW-PUSH-CMS_BLUE: Non-Open Push-Button 0.1A 24V; Manuf_2: FARNELL; Manuf_Part_2: 535-930; Manuf_1: wealthmetal; Manuf_Part_1: TD0341X-G01-BLU; Ref St: 9180120; Description: Non-Open Push Button,Blue 0.1A 24V,Square head,6*6,SMT,180Degree,TD-0341X-GO1,wealthmetal; Distrib: *
B2 = SW-PUSH-CMS_BLACK: Non-Open Push-Button 0.1A 24V; Manuf_2: FARNELL; Manuf_Part_2: 535-930; Manuf_1: wealthmetal; Manuf_Part_1: TD0341X-G01-BLA; Ref St: 9180120; Description: Non-Open Push Button,Black 0.1A 24V,Square head,6*6,SMT,180Degree,TD-0341X-GO1,wealthmetal; Distrib: *
C36 = Cap_NA_0402: Capacitor,NA,0402; Fitted: NO; Revision: July-2002: Re-released for DXP Platform.; Value: [NA]
C37 C43 = Cap_10uF_X5R_10%_0603: as C65 on sheet Audio; Revision: July-2002: Re-released for DXP Platform.; Value: 10uF; Order: CC0603KRX5R5BB106; Manuf_1: YAGEO
C39 C40 C55 = Cap_100nF_X7R_10%_0402: as C2 on sheet ST_LINK_V2; Revision: July-2002: Re-released for DXP Platform.; Value: 100nF; Order: CC0402KRX7R7BB104; Manuf_1: YAGEO
C41 = Cap_220nF_X7R_10%_0603: Capacitor,220nF,16V,X7R,10%,0603,YAGEO; Manuf_Part_1: CC0603KRX7R7BB224; Revision: July-2002: Re-released for DXP Platform.; Value: 220nF; Order: CC0603KRX7R7BB224; Manuf_1: YAGEO
C42 = Cap_4.7uF_X5R_10%_0603: Capacitor,4.7uF,16V, X5R,10%,0603,YAGEO; Manuf_Part_1: CC0603KRX5R7BB475; Order: CC0603KRX5R7BB105; Revision: July-2002: Re-released for DXP Platform.; Value: 4.7uF; Manuf_1: YAGEO
C48 = Cap_10nF_X7R_10%_0603: as C5 on sheet ST_LINK_V2; Revision: July-2002: Re-released for DXP Platform.; Value: 10nF; Order: CC0603KRX7R9BB103; Manuf_1: YAGEO
LD3 = LED_orange: LED, orange, 0603; Manuf_1: everlight; Manuf_Part_1: 19-217/S2C-AM2N2VY/3T; Description: LED,orange,0603,19-217/S2C-AM2N2VY/3T,everlight; Order: 19-217/S2C-AM2N2VY/3T
LD4 = LED_green: LED, green, 0603; Manuf_1: everlight; Manuf_Part_1: 19-213SYGC/S530-E2/TR8; Description: LED,green,0603,19-213SYGC/S530-E2/TR8,everlight; Order: 19-213SYGC/S530-E2/TR8
LD5 = LED_red: as LD2 on sheet ST_LINK_V2; Order: 19-213-R6C-AP1Q2B/3T
LD6 = LED_blue: LED, blue, 0603; Manuf_1: everlight; Manuf_Part_1: 19-217/BHC-ZL1M2RY/3T; Description: LED,Blue,0603,19-217/BHC-ZL1M2RY/3T,everlight; Order: 19-217/BHC-ZL1M2RY/3T
R33 = Res_NA_0402: Resistor,[NA],0402; Fitted: NO; Value: [NA]
R34 = res1: Resistor; Published: 8-Jun-2000; Revision: July-2002: Re-released for DXP Platform.; Publisher: Altium Limited; Value: 330
R35 = res1: Resistor; Value: 10K; Published: 8-Jun-2000; Revision: July-2002: Re-released for DXP Platform.; Publisher: Altium Limited
R36 R39 = Res1: Resistor; Published: 8-Jun-2000; Revision: July-2002: Re-released for DXP Platform.; Publisher: Altium Limited; Value: 1K
R37 = res1: Resistor; Value: 330; Published: 8-Jun-2000; Revision: July-2002: Re-released for DXP Platform.; Publisher: Altium Limited
R38 R40 = Res1: Resistor; Value: 1K; Published: 8-Jun-2000; Revision: July-2002: Re-released for DXP Platform.; Publisher: Altium Limited
SB1 SB21 = Circuit Breaker: Solder: YES; Revision: July-2002: Re-released for DXP Platform.
U5 = LSM303DLHC: Ultra compact high performance e-compass 3D accelerometer and 3D magnetometer module; Manuf_1: STM; Manuf_Part_1: LSM303DLHCTR; Provided: ST; Ref St: 9177037; ECCN_US/EU: EAR99/NEC; Distrib: ST; Order: LSM303DLHCTR
U7 = L3GD20: MEMS motion sensor three-axis digital output gyroscopeelerometer; Manuf_1: STM; Manuf_Part_1: L3GD20TR; Provided: ST; Ref St: 9177042; ECCN_US/EU: EAR99/NEC; Distrib: ST; Footprint: LGA16(4*4); Order: L3GD20TR

## Sheet STM32Fx.SchDoc
size A4; DocumentNumber: 3; Revision: B.2(PCB.SCH); SheetNumber: 3; SheetTotal: 6
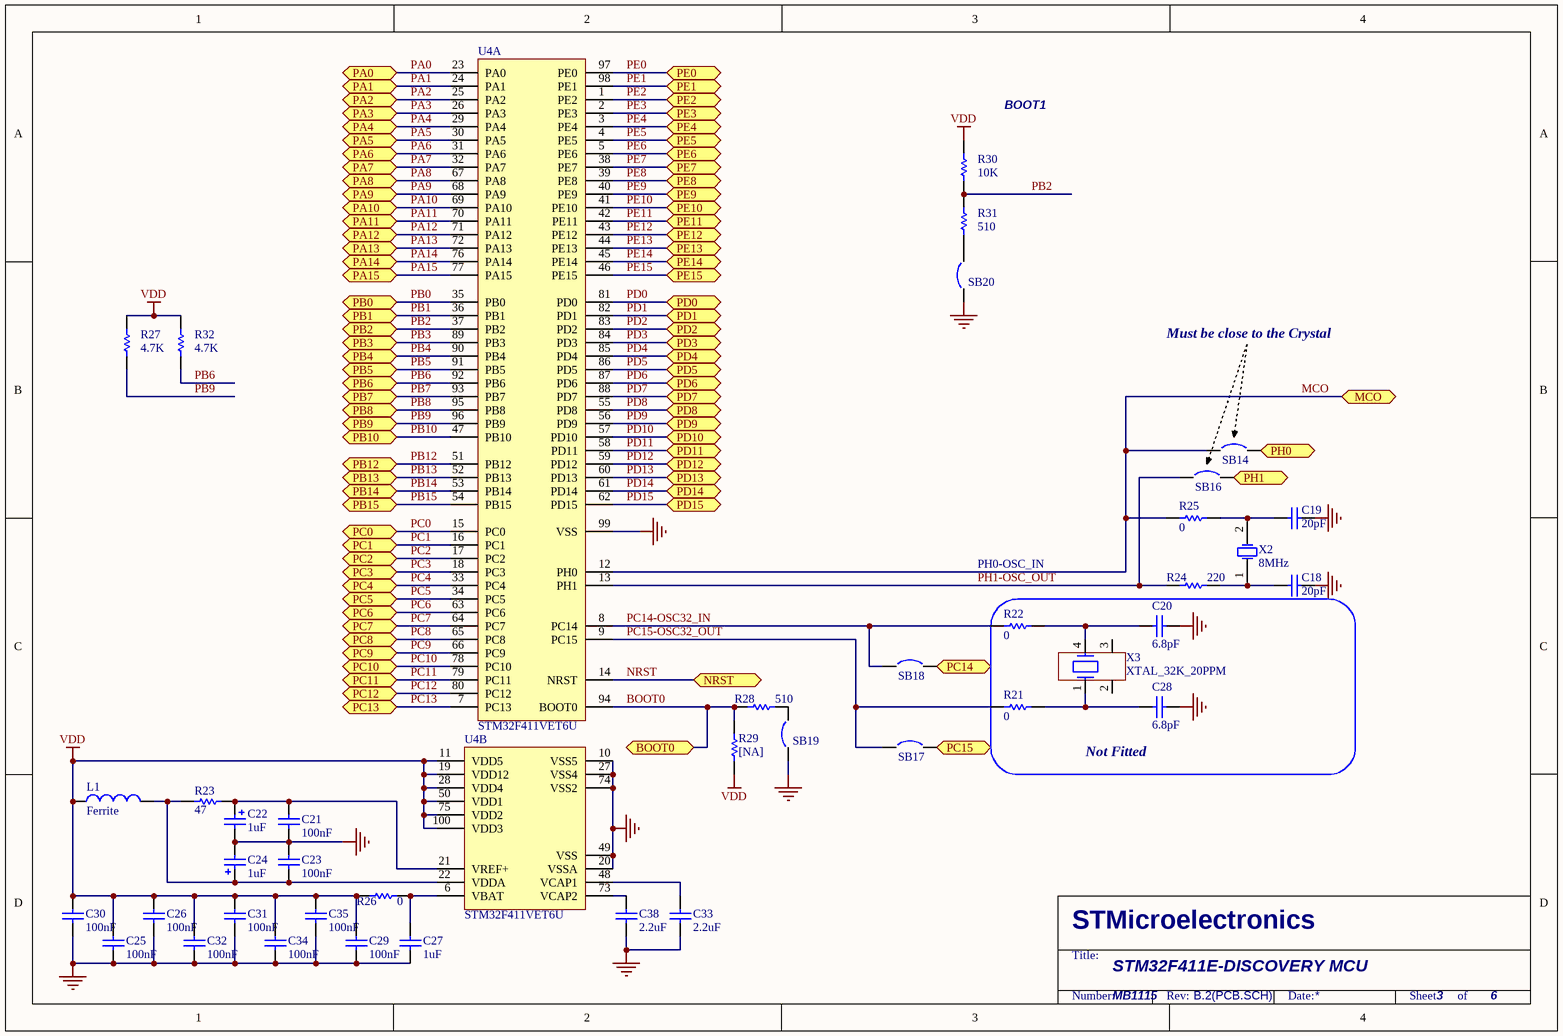
[diagram p4: STM32Fx.SchDoc]

### Parts
C18  20pF  [0402C]
C19  20pF  [0402C]
C20  6.8pF  [0402C]
C21  100nF  [0402C]
C22  1uF  [TAN-A]
C23  100nF  [0402C]
C24  1uF  [TAN-A]
C25  100nF  [0402C]
C26  100nF  [0402C]
C27  1uF  [0603C]
C28  6.8pF  [0402C]
C29  100nF  [0402C]
C30  100nF  [0402C]
C31  100nF  [0402C]
C32  100nF  [0402C]
C33  2.2uF  [TAN-A]
C34  100nF  [0402C]
C35  100nF  [0402C]
C38  2.2uF  [TAN-A]
L1  Ferrite  [0603L]
R21  0  [0402R]
R22  0  [0402R]
R23  47  [0402R]
R24  220  [0402R]
R25  0  [0402R]
R26  0  [0402R]
R27  4.7K  [0402R]
R28  510  [0402R]
R29  [NA]  [0402R]
R30  10K  [0402R]
R31  510  [0402R]
R32  4.7K  [0402R]
SB14  Circuit Breaker  [JP2_SMD]  (value not drawn)
SB16  Circuit Breaker  [JP2_SMD]  (value not drawn)
SB17  Circuit Breaker  [JP2_SMD]  (value not drawn)
SB18  Circuit Breaker  [JP2_SMD]  (value not drawn)
SB19  Circuit Breaker  [JP2_SMD]  (value not drawn)
SB20  Circuit Breaker  [JP2_SMD]  (value not drawn)
U4  STM32F411VET6U  [TQFP100]  (parts A,B of 2)
X2  8MHz  [XTAL1]
X3  XTAL_32K_20PPM  [MC306-CRYSTAL]

### Blocks framed on the sheet
Not Fitted: C20 C28 R21 R22 X3

### Ports
BOOT0, MCO, NRST, PA0, PA1, PA2, PA3, PA4, PA5, PA6, PA7, PA8, PA9, PA10, PA11, PA12, PA13, PA14, PA15, PB0, PB1, PB2, PB3, PB4, PB5, PB6, PB7, PB8, PB9, PB10, PB12, PB13, PB14, PB15, PC0, PC1, PC2, PC3, PC4, PC5, PC6, PC7, PC8, PC9, PC10, PC11, PC12, PC13, PC14, PC15, PD0, PD1, PD2, PD3, PD4, PD5, PD6, PD7, PD8, PD9, PD10, PD11, PD12, PD13, PD14, PD15, PE0, PE1, PE2, PE3, PE4, PE5, PE6, PE7, PE8, PE9, PE10, PE11, PE12, PE13, PE14, PE15, PH0, PH1

### Nets
GND: C18.1 C19.1 C20.2 C21.1 C22.2 C23.1 C24.2 C25.1 C26.2 C27.2 C28.2 C29.1 C30.1 C31.1 C32.1 C33.2 C34.1 C35.2 C38.2 SB19.1 SB20.1 U4.10(VSS5) U4.20(VSSA) U4.27(VSS4) U4.49(VSS) U4.74(VSS2) U4.99(VSS)
VDD: C25.2 C26.1 C29.2 C30.2 C31.2 C32.2 C34.2 C35.1 L1.1 R26.1 R27.1 R29.1 R30.1 R32.1 U4.11(VDD5) U4.19(VDD12) U4.28(VDD4) U4.50(VDD1) U4.75(VDD2) U4.100(VDD3)
BOOT0: R28.2 R29.2 U4.94(BOOT0) ; port BOOT0
MCO: R25.1 SB14.1 U4.12(PH0) ; port MCO
NRST: U4.14(NRST) ; port NRST
PA0: U4.23(PA0) ; port PA0
PA1: U4.24(PA1) ; port PA1
PA2: U4.25(PA2) ; port PA2
PA3: U4.26(PA3) ; port PA3
PA4: U4.29(PA4) ; port PA4
PA5: U4.30(PA5) ; port PA5
PA6: U4.31(PA6) ; port PA6
PA7: U4.32(PA7) ; port PA7
PA8: U4.67(PA8) ; port PA8
PA9: U4.68(PA9) ; port PA9
PA10: U4.69(PA10) ; port PA10
PA11: U4.70(PA11) ; port PA11
PA12: U4.71(PA12) ; port PA12
PA13: U4.72(PA13) ; port PA13
PA14: U4.76(PA14) ; port PA14
PA15: U4.77(PA15) ; port PA15
PB0: U4.35(PB0) ; port PB0
PB1: U4.36(PB1) ; port PB1
PB2: R30.2 R31.1 U4.37(PB2) ; port PB2
PB3: U4.89(PB3) ; port PB3
PB4: U4.90(PB4) ; port PB4
PB5: U4.91(PB5) ; port PB5
PB6: R32.2 U4.92(PB6) ; port PB6
PB7: U4.93(PB7) ; port PB7
PB8: U4.95(PB8) ; port PB8
PB9: R27.2 U4.96(PB9) ; port PB9
PB10: U4.47(PB10) ; port PB10
PB12: U4.51(PB12) ; port PB12
PB13: U4.52(PB13) ; port PB13
PB14: U4.53(PB14) ; port PB14
PB15: U4.54(PB15) ; port PB15
PC0: U4.15(PC0) ; port PC0
PC1: U4.16(PC1) ; port PC1
PC2: U4.17(PC2) ; port PC2
PC3: U4.18(PC3) ; port PC3
PC4: U4.33(PC4) ; port PC4
PC5: U4.34(PC5) ; port PC5
PC6: U4.63(PC6) ; port PC6
PC7: U4.64(PC7) ; port PC7
PC8: U4.65(PC8) ; port PC8
PC9: U4.66(PC9) ; port PC9
PC10: U4.78(PC10) ; port PC10
PC11: U4.79(PC11) ; port PC11
PC12: U4.80(PC12) ; port PC12
PC13: U4.7(PC13) ; port PC13
PC14: SB18.2 ; port PC14
PC14-OSC32_IN: R22.1 SB18.1 U4.8(PC14)
PC15: SB17.2 ; port PC15
PC15-OSC32_OUT: R21.1 SB17.1 U4.9(PC15)
PD0: U4.81(PD0) ; port PD0
PD1: U4.82(PD1) ; port PD1
PD2: U4.83(PD2) ; port PD2
PD3: U4.84(PD3) ; port PD3
PD4: U4.85(PD4) ; port PD4
PD5: U4.86(PD5) ; port PD5
PD6: U4.87(PD6) ; port PD6
PD7: U4.88(PD7) ; port PD7
PD8: U4.55(PD8) ; port PD8
PD9: U4.56(PD9) ; port PD9
PD10: U4.57(PD10) ; port PD10
PD11: U4.58(PD11) ; port PD11
PD12: U4.59(PD12) ; port PD12
PD13: U4.60(PD13) ; port PD13
PD14: U4.61(PD14) ; port PD14
PD15: U4.62(PD15) ; port PD15
PE0: U4.97(PE0) ; port PE0
PE1: U4.98(PE1) ; port PE1
PE2: U4.1(PE2) ; port PE2
PE3: U4.2(PE3) ; port PE3
PE4: U4.3(PE4) ; port PE4
PE5: U4.4(PE5) ; port PE5
PE6: U4.5(PE6) ; port PE6
PE7: U4.38(PE7) ; port PE7
PE8: U4.39(PE8) ; port PE8
PE9: U4.40(PE9) ; port PE9
PE10: U4.41(PE10) ; port PE10
PE11: U4.42(PE11) ; port PE11
PE12: U4.43(PE12) ; port PE12
PE13: U4.44(PE13) ; port PE13
PE14: U4.45(PE14) ; port PE14
PE15: U4.46(PE15) ; port PE15
PH0: SB14.2 ; port PH0
PH1: SB16.2 ; port PH1
PH1-OSC_OUT: R24.2 SB16.1 U4.13(PH1)
NetC18_2: C18.2 R24.1 X2.1(OSC1)
NetC19_2: C19.2 R25.2 X2.2(OSC2)
NetC20_1: C20.1 R22.2 X3.4
NetC21_2: C21.2 C22.1 R23.1 U4.21(VREF+)
NetC23_2: C23.2 C24.1 L1.2 R23.2 U4.22(VDDA)
NetC27_1: C27.1 R26.2 U4.6(VBAT)
NetC28_1: C28.1 R21.2 X3.1
NetC33_1: C33.1 U4.48(VCAP1)
NetC38_1: C38.1 U4.73(VCAP2)
NetR28_1: R28.1 SB19.2
NetR31_2: R31.2 SB20.2

Not connected (* = marked no-connect by the designer): X3 2 3

### Notes on the sheet
- BOOT1
- Must be close to the Crystal
- PH0-OSC_IN
- STM32F411E-DISCOVERY MCU
- MB1115
- STMicroelectronics
- Title:
- Number:
- Rev:
- Date:
- Sheet       of

### Library data of the parts
C18 C19 = Cap_20pF_NPO_5%_0402: as C6 on sheet ST_LINK_V2; Revision: July-2002: Re-released for DXP Platform.; Value: 20pF; Manuf_1: YAGEO; Manuf_Part_1: CC0402JRNPO9BN200
C20 C28 = Cap_6.8pF_NPO_4%_0402: Capacitor,6.8pF,50V,NPO,4%,0402,AVX; Order: 04025A6R8CAT2A; Fitted: NO; Revision: July-2002: Re-released for DXP Platform.; Value: 6.8pF; Manuf_1: AVX; Manuf_Part_1: 04025A6R8CAT2A
C21 C23 C25 C26 C29-C32 C34 C35 = Cap_100nF_X7R_10%_0402: as C2 on sheet ST_LINK_V2; Revision: July-2002: Re-released for DXP Platform.; Value: 100nF; Order: CC0402KRX7R7BB104; Manuf_1: YAGEO
C22 C24 = Cap_1uF_POL_10%_TANA: as C64 on sheet Audio; Revision: July-2002: Re-released for DXP Platform.; Value: 1uF; Order: TAJA105K016R; Manuf_1: AVX; Distrib: *
C27 = Cap_1uF_X5R_10%_0603: as C1 on sheet ST_LINK_V2; Revision: July-2002: Re-released for DXP Platform.; Value: 1uF; Order: CC0603KRX5R7BB105; Manuf_1: YAGEO
C33 C38 = Cap_2.2uF_X7R_10%_0805: Capacitor,2.2uF,16V, X7R,10%,0805,YAGEO; Manuf_Part_1: CC0805KKX7R7BB225; Revision: July-2002: Re-released for DXP Platform.; Value: 2.2uF; Order: CC0805KKX7R7BB225; Manuf_1: YAGEO
L1 = BEAD_600R_350MA_0603: Bead,600R,350mA,0603,FCM1608KF-601T03,Tai-tech; Manuf_2: TDK; Manuf_Part_2: MPZ1608S300A; Value: 100uH; Comment_1: bead,30R,5A,0603,MPZ1608S300A,TDK; Revision: July-2002: Re-released for DXP Platform.; Manuf_Part_1: FCM1608KF-601T03; Order: FCM1608KF-601T03; Manuf_1: Tai-tech
R21 R22 = Res_0_0402: Resistor,0,0402; Fitted: NO; Value: 0
R23 = Res1: Resistor; Value: 1K; Published: 8-Jun-2000; Revision: July-2002: Re-released for DXP Platform.; Publisher: Altium Limited
R24 R28 = Res1: Resistor; Published: 8-Jun-2000; Revision: July-2002: Re-released for DXP Platform.; Publisher: Altium Limited
  R24: Value: 220
  R28: Value: 510
R25 R26 = Res_0_0402: Resistor,0,0402; Value: 0
R27 R32 = res1: Resistor; Value: 10K; Published: 8-Jun-2000; Revision: July-2002: Re-released for DXP Platform.; Publisher: Altium Limited
R29 = Res_NA_0402: Resistor,[NA],0402; Fitted: NO; Value: [NA]
R30 R31 = res1: Resistor; Published: 8-Jun-2000; Revision: July-2002: Re-released for DXP Platform.; Publisher: Altium Limited
  R30: Value: 10K
  R31: Value: 510
SB14 SB16 SB20 = Circuit Breaker: Solder: NO; Revision: July-2002: Re-released for DXP Platform.
SB17-SB19 = Circuit Breaker: Solder: YES; Revision: July-2002: Re-released for DXP Platform.
U4 = STM32F401VCT6U: STM32 Tiny Manta (STM32F401VCT6U); Manuf_1: STM; Provided: ST; Ref St: 9175846; ECCN_US/EU: 3A991A2/NEC; Manuf_Part_1: STM32F401VCT6U; Distrib: ST; Footprint: QFP100
X2 = XTAL_8MHZ_20PPM: as X1 on sheet ST_LINK_V2; Order: HC-49S-C20QSA-8.000MHZ
X3 = XTAL_32K: Crystal oscillator for clock,32.768K,6PF,20PPM,-40~85 degree,SMT; Manuf_Part_1: ETMB32.768W060BMPF; Description: crystal oscillator for clock,32.768K,6PF,20PPM,-40~85 degree,SMT,ETMB32.768W060BMPF; Comment_1: MC306-G-06Q-32.768; Fitted: NO; Order: ETMB32.768W060BMPF

## Sheet USB_OTG_FS.SchDoc
size A4; DocumentNumber: 5; Revision: B.2(PCB.SCH); SheetNumber: 5; SheetTotal: 6
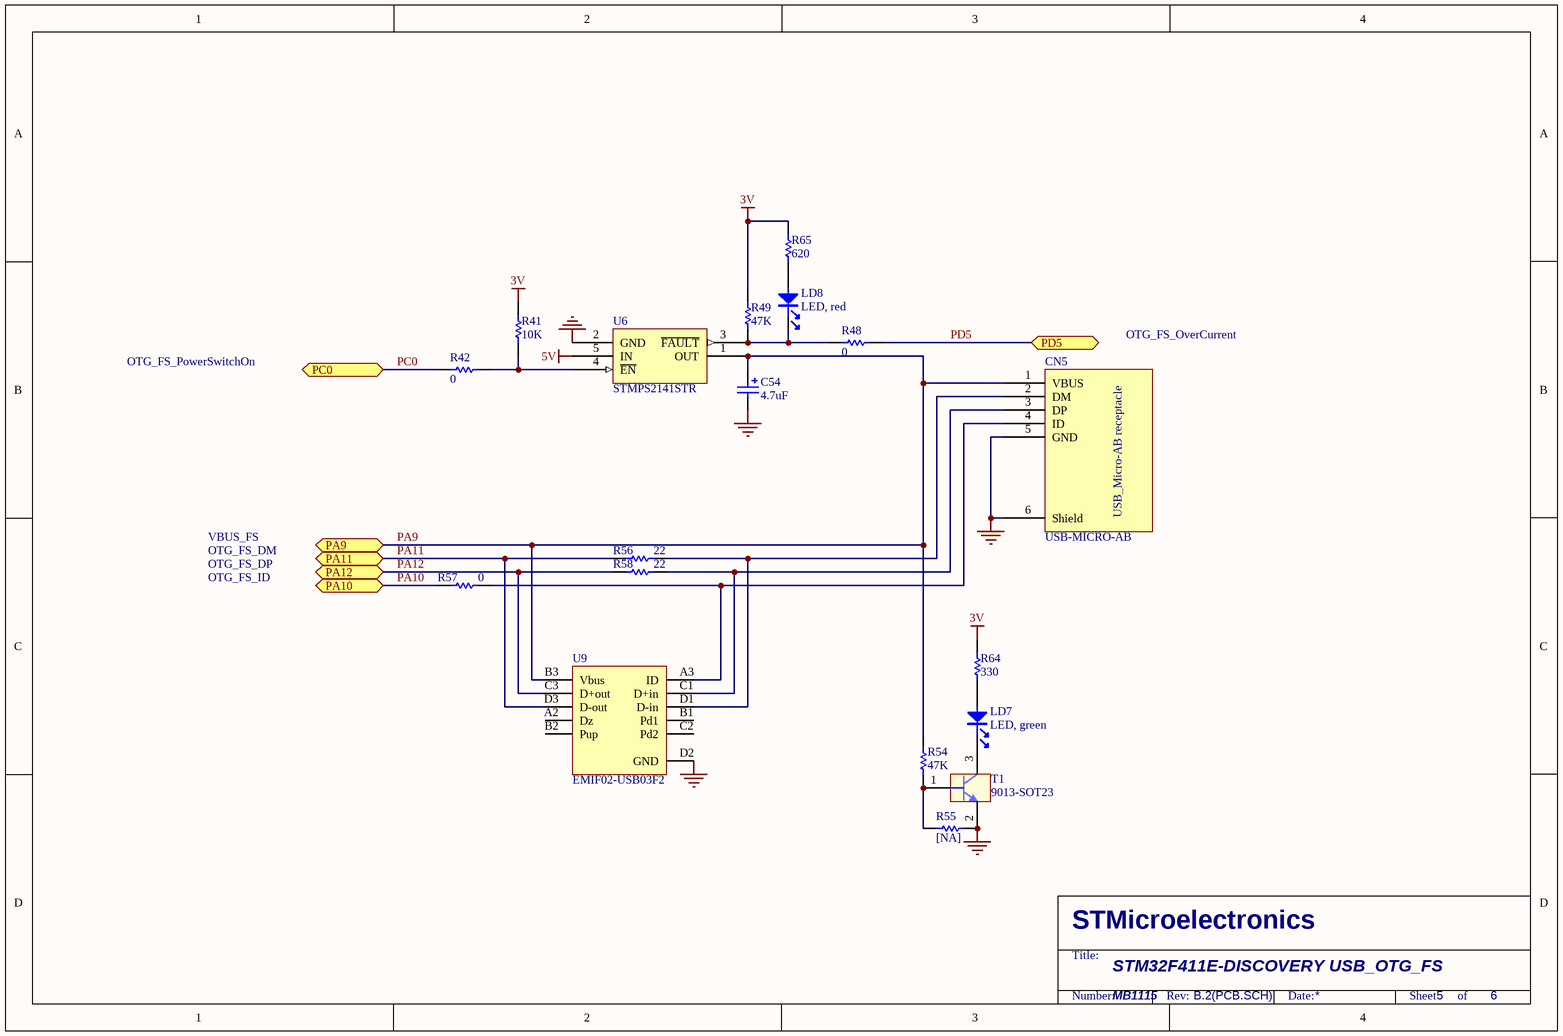
[diagram p5: USB_OTG_FS.SchDoc]

### Parts
C54  4.7uF  [TAN-A]
CN5  USB-MICRO-AB  [USB-MICRO-AB]
LD7  LED, green  [0603D]
LD8  LED, red  [0603D]
R41  10K  [0402R]
R42  0  [0402R]
R48  0  [0402R]
R49  47K  [0402R]
R54  47K  [0402R]
R55  [NA]  [0402R]
R56  22  [0402R]
R57  0  [0402R]
R58  22  [0402R]
R64  330  [0603R]
R65  620  [0603R]
T1  9013-SOT23  [SOT-23]
U6  STMPS2141STR  [SOT23-5L]
U9  EMIF02-USB03F2  [Flip Chip]

### Ports
PA9, PA10, PA11, PA12, PC0, PD5

### Nets
3V: R41.1 R49.1 R64.2 R65.2
5V: U6.5(IN)
GND: C54.2 CN5.5(GND) CN5.6(Shield) R55.2 T1.2(E) U6.2(GND) U9.D2(GND)
PA9: C54.1 CN5.1(VBUS) R54.2 U6.1(OUT) U9.B3(Vbus) ; port PA9
PA10: R57.1 ; port PA10
PA11: R56.2 U9.D3(D-out) ; port PA11
PA12: R58.2 U9.C3(D+out) ; port PA12
PC0: R42.1 ; port PC0
PD5: R48.2 ; port PD5
NetCN5_2: CN5.2(DM) R56.1 U9.D1(D-in)
NetCN5_3: CN5.3(DP) R58.1 U9.C1(D+in)
NetCN5_4: CN5.4(ID) R57.2 U9.A3(ID)
NetLD7_1: LD7.1 R64.1
NetLD7_2: LD7.2 T1.3(C)
NetLD8_1: LD8.1 R65.1
NetLD8_2: LD8.2 R48.1 R49.2 U6.3(~{FAULT})
NetR41_2: R41.2 R42.2 U6.4(~{EN})
NetR54_1: R54.1 R55.1 T1.1(B)

Not connected (* = marked no-connect by the designer): U9 A2(Dz) B1(Pd1) B2(Pup) C2(Pd2)

### Notes on the sheet
- OTG_FS_PowerSwitchOn
- OTG_FS_OverCurrent
- VBUS_FS
- OTG_FS_ID
- OTG_FS_DM
- OTG_FS_DP
- STM32F411E-DISCOVERY USB_OTG_FS
- MB1115
- STMicroelectronics
- Title:
- Number:
- Rev:
- Date:
- Sheet       of
- (in symbol USB-MICRO-AB) USB_Micro-AB receptacle

### Library data of the parts
C54 = Cap_4.7uF_POL_10%_TANA: Polarized Capacitor,4.7uF,16V,10%,typeA,AVX; Manuf_Part_1: TAJA475K016R; Revision: July-2002: Re-released for DXP Platform.; Value: 4.7uF; Manuf_1: AVX; Order: TAJA475K016R
CN5 = USB-MICRO-AB: USB-MICRO-AB, 47590-0001, SMT, MOLEX; Ref St: xxxxxxx; Manuf_1: MOLEX; Manuf_Part_1: 47590-0001; ECCN_US/EU: *; Distrib: *
LD7 = LED_green: as LD4 on sheet IO Peripherals; Order: 19-213SYGC/S530-E2/TR8
LD8 = LED_red: as LD2 on sheet ST_LINK_V2; Order: 19-213-R6C-AP1Q2B/3T
R41 R49 R54 R64 = res1: Resistor; Value: 1K; Published: 8-Jun-2000; Revision: July-2002: Re-released for DXP Platform.; Publisher: Altium Limited
R42 R48 R57 = Res_0_0402: Resistor,0,0402; Value: 0
R55 = Res_NA_0402: Resistor,[NA],0402; Fitted: NO; Value: [NA]
R56 R58 R65 = Res1: Resistor; Value: 1K; Published: 8-Jun-2000; Revision: July-2002: Re-released for DXP Platform.; Publisher: Altium Limited
T1 = 9013-SOT23: NPN Bipolar Transistor; Manuf_1: unisonic; Manuf_Part_1: MMBT9013; Description: NPN Bipolar Transistor, SOT-23 Footprint; Revision: July-2002: Re-released for DXP Platform.; Order: MMBT9013
U6 = STMPS2141STR: Enhanced single channel power switches; Manuf_1: STM; Provided: ST; ECCN_US/EU: EAR99/NEC; Ref St: 9159003; Order: STMPS2141STR; Manuf_Part_1: STMPS2141STR; Distrib: ST
U9 = EMIF02-USB03F2: 2-line IPAD, EMI filter including ESD protection; Manuf_1: STM; Provided: ST; ECCN_US/EU: EAR99/NEC; Ref St: 9179037; Order: EMIF02-USB03F2; Manuf_Part_1: EMIF02-USB03F2; Distrib: ST

## Nets that join several sheets
2V5: ST_LINK_V2 (C14.1 C15.2 U3.5), Audio (7 pins)
3V: MB1115 (P2.5 P2.6), ST_LINK_V2 (17 pins), Audio (10 pins), IO Peripherals (9 pins), USB_OTG_FS (R41.1 R49.1 R64.2 R65.2)
5V: MB1115 (P2.3 P2.4), ST_LINK_V2 (9 pins), USB_OTG_FS (U6.5)
GND: MB1115 (10 pins), ST_LINK_V2 (42 pins), Audio (29 pins), IO Peripherals (23 pins), STM32Fx (27 pins), USB_OTG_FS (7 pins)
VDD: MB1115 (P1.3 P1.4 P2.22), ST_LINK_V2 (JP2.2), IO Peripherals (B1.1 B1.4 R33.2 R37.2), STM32Fx (20 pins)
BOOT0: MB1115 (P2.21), STM32Fx (R28.2 R29.2 U4.94)
MCO: ST_LINK_V2 (C67.1 R66.2), STM32Fx (R25.1 SB14.1 U4.12)
NRST: MB1115 (P1.6), ST_LINK_V2 (SB13.2), IO Peripherals (SB1.1), STM32Fx (U4.14)
PA0: MB1115 (P1.12), IO Peripherals (SB21.1), STM32Fx (U4.23)
PA1: MB1115 (P1.11), STM32Fx (U4.24)
PA2: MB1115 (P1.14), ST_LINK_V2 (SB10.1), STM32Fx (U4.25)
PA3: MB1115 (P1.13), ST_LINK_V2 (SB11.1), STM32Fx (U4.26)
PA4: MB1115 (P1.16), Audio (R46.2 U8.40), STM32Fx (U4.29)
PA5: MB1115 (P1.15), IO Peripherals (U7.2), STM32Fx (U4.30)
PA6: MB1115 (P1.18), IO Peripherals (U7.4), STM32Fx (U4.31)
PA7: MB1115 (P1.17), IO Peripherals (U7.3), STM32Fx (U4.32)
PA8: MB1115 (P2.43), STM32Fx (U4.67)
PA9: MB1115 (P2.44), STM32Fx (U4.68), USB_OTG_FS (5 pins)
PA10: MB1115 (P2.41), STM32Fx (U4.69), USB_OTG_FS (R57.1)
PA11: STM32Fx (U4.70), USB_OTG_FS (R56.2 U9.D3)
PA12: STM32Fx (U4.71), USB_OTG_FS (R58.2 U9.C3)
PA13: MB1115 (P2.42), ST_LINK_V2 (SB9.1), STM32Fx (U4.72)
PA14: MB1115 (P2.39), ST_LINK_V2 (SB5.1), STM32Fx (U4.76)
PA15: MB1115 (P2.40), STM32Fx (U4.77)
PB0: MB1115 (P1.22), STM32Fx (U4.35)
PB1: MB1115 (P1.21), STM32Fx (U4.36)
PB2: MB1115 (P1.24), STM32Fx (R30.2 R31.1 U4.37)
PB3: MB1115 (P2.28), ST_LINK_V2 (SB15.2), STM32Fx (U4.89)
PB4: MB1115 (P2.25), STM32Fx (U4.90)
PB5: MB1115 (P2.26), STM32Fx (U4.91)
PB6: MB1115 (P2.23), Audio (U8.2), IO Peripherals (U5.2), STM32Fx (R32.2 U4.92)
PB7: MB1115 (P2.24), STM32Fx (U4.93)
PB8: MB1115 (P2.19), STM32Fx (U4.95)
PB9: MB1115 (P2.20), Audio (U8.1), IO Peripherals (U5.3), STM32Fx (R27.2 U4.96)
PB10: MB1115 (P1.34), Audio (U10.4), STM32Fx (U4.47)
PB12: MB1115 (P1.36), STM32Fx (U4.51)
PB13: MB1115 (P1.37), STM32Fx (U4.52)
PB14: MB1115 (P1.38), STM32Fx (U4.53)
PB15: MB1115 (P1.39), STM32Fx (U4.54)
PC0: MB1115 (P1.8), STM32Fx (U4.15), USB_OTG_FS (R42.1)
PC1: MB1115 (P1.7), STM32Fx (U4.16)
PC2: MB1115 (P1.10), STM32Fx (U4.17)
PC3: MB1115 (P1.9), Audio (R53.2 U10.5), STM32Fx (U4.18)
PC4: MB1115 (P1.20), Audio (R47.2), STM32Fx (U4.33)
PC5: MB1115 (P1.19), STM32Fx (U4.34)
PC6: MB1115 (P2.47), STM32Fx (U4.63)
PC7: MB1115 (P2.48), Audio (U8.37), STM32Fx (U4.64)
PC8: MB1115 (P2.45), STM32Fx (U4.65)
PC9: MB1115 (P2.46), STM32Fx (U4.66)
PC10: MB1115 (P2.37), Audio (U8.38), STM32Fx (U4.78)
PC11: MB1115 (P2.38), STM32Fx (U4.79)
PC12: MB1115 (P2.35), Audio (U8.39), STM32Fx (U4.80)
PC13: MB1115 (P2.12), STM32Fx (U4.7)
PC14: MB1115 (P2.9), STM32Fx (SB18.2)
PC15: MB1115 (P2.10), STM32Fx (SB17.2)
PD0: MB1115 (P2.36), STM32Fx (U4.81)
PD1: MB1115 (P2.33), STM32Fx (U4.82)
PD2: MB1115 (P2.34), STM32Fx (U4.83)
PD3: MB1115 (P2.31), STM32Fx (U4.84)
PD4: MB1115 (P2.32), Audio (R43.1 U8.32), STM32Fx (U4.85)
PD5: MB1115 (P2.29), STM32Fx (U4.86), USB_OTG_FS (R48.2)
PD6: MB1115 (P2.30), STM32Fx (U4.87)
PD7: MB1115 (P2.27), STM32Fx (U4.88)
PD8: MB1115 (P1.40), STM32Fx (U4.55)
PD9: MB1115 (P1.41), STM32Fx (U4.56)
PD10: MB1115 (P1.42), STM32Fx (U4.57)
PD11: MB1115 (P1.43), STM32Fx (U4.58)
PD12: MB1115 (P1.44), IO Peripherals (R38.2), STM32Fx (U4.59)
PD13: MB1115 (P1.45), IO Peripherals (R36.2), STM32Fx (U4.60)
PD14: MB1115 (P1.46), IO Peripherals (R39.2), STM32Fx (U4.61)
PD15: MB1115 (P1.47), IO Peripherals (R40.2), STM32Fx (U4.62)
PE0: MB1115 (P2.17), IO Peripherals (U7.7), STM32Fx (U4.97)
PE1: MB1115 (P2.18), IO Peripherals (U7.6), STM32Fx (U4.98)
PE2: MB1115 (P2.15), IO Peripherals (U5.9), STM32Fx (U4.1)
PE3: MB1115 (P2.16), IO Peripherals (U7.5), STM32Fx (U4.2)
PE4: MB1115 (P2.13), IO Peripherals (U5.5), STM32Fx (U4.3)
PE5: MB1115 (P2.14), IO Peripherals (U5.4), STM32Fx (U4.4)
PE6: MB1115 (P2.11), STM32Fx (U4.5)
PE7: MB1115 (P1.25), STM32Fx (U4.38)
PE8: MB1115 (P1.26), STM32Fx (U4.39)
PE9: MB1115 (P1.27), STM32Fx (U4.40)
PE10: MB1115 (P1.28), STM32Fx (U4.41)
PE11: MB1115 (P1.29), STM32Fx (U4.42)
PE12: MB1115 (P1.30), STM32Fx (U4.43)
PE13: MB1115 (P1.31), STM32Fx (U4.44)
PE14: MB1115 (P1.32), STM32Fx (U4.45)
PE15: MB1115 (P1.33), STM32Fx (U4.46)
PH0: MB1115 (P2.7), STM32Fx (SB14.2)
PH1: MB1115 (P2.8), STM32Fx (SB16.2)